# EAGLE design CoffeePal (EAGLE 9.6.2)
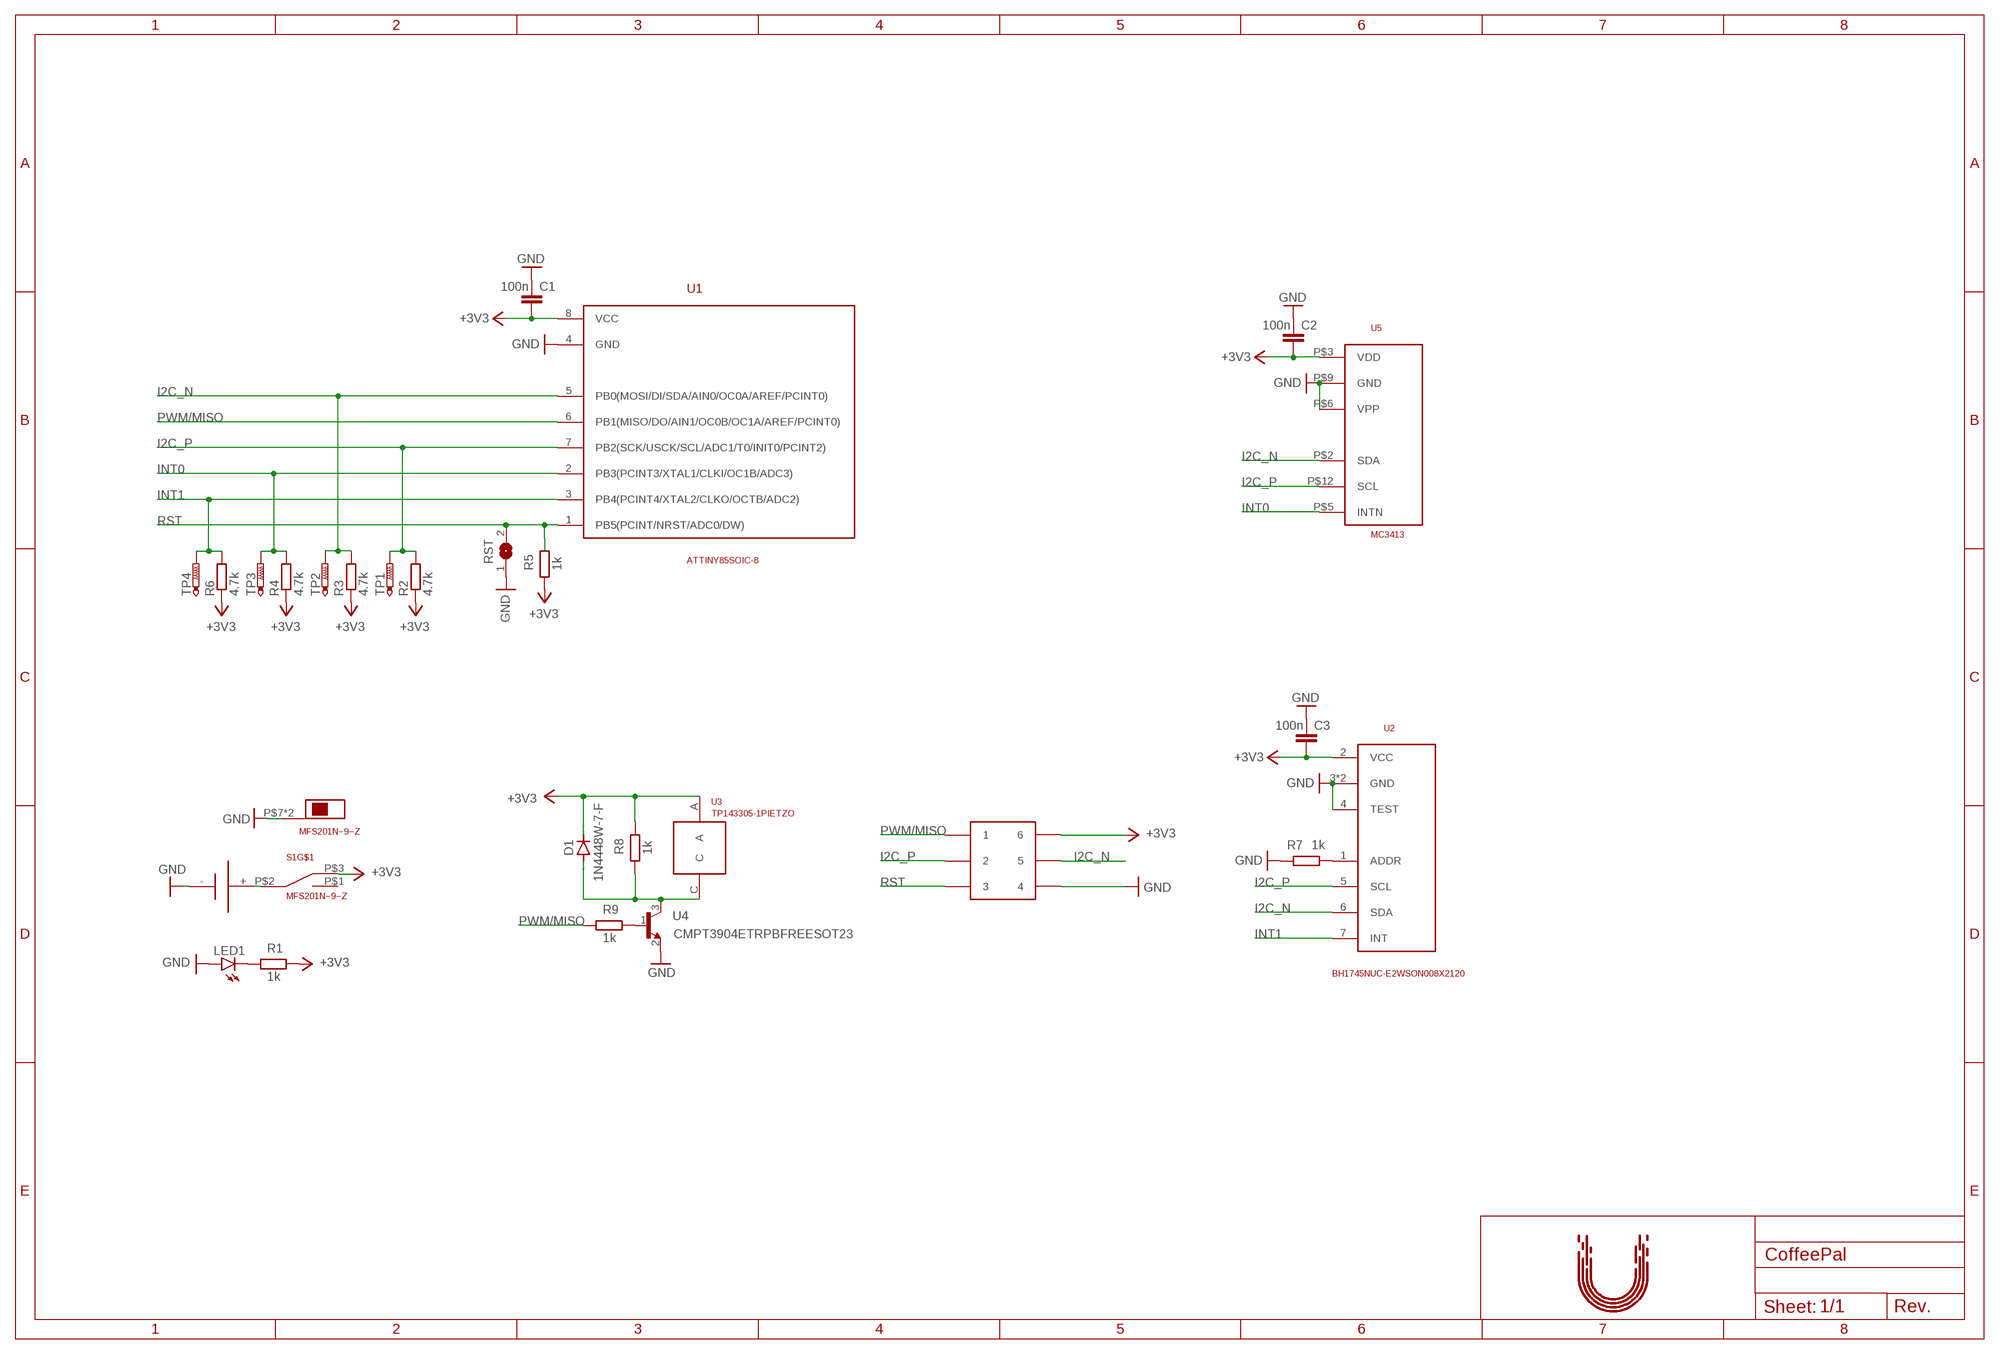
[diagram p0: schematic, sheet 1]

## Parts
C1  100n  CAPACITORC-0603  [0603]
C2  100n  CAPACITORC-0603  [0603]
C3  100n  CAPACITORC-0603  [0603]
D1  1N4448W-7-F  DIODE1  [SOD-123_MINI-SMA]
LED1  LEDLED_1206  [DIOC3216X75N]
PROGRAM  3X2_PINHEADER3X2_PINHEADER  [HDRV6W64P254_2X3_900X508X838B]
R1  1k  RESISTOR  [R0603]
R2  4.7k  RESISTOR  [R0603]
R3  4.7k  RESISTOR  [R0603]
R4  4.7k  RESISTOR  [R0603]
R5  1k  RESISTOR  [R0603]
R6  4.7k  RESISTOR  [R0603]
R7  1k  RESISTOR  [R0603]
R8  1k  RESISTOR  [R0603]
R9  1k  RESISTOR  [R0603]
RST  JUMPER  [SJ]
S1  MFS201N−9−Z  [MFS201N-9-Z]
TP1  PTR1B1,27  [B1,27]
TP2  PTR1B1,27  [B1,27]
TP3  PTR1B1,27  [B1,27]
TP4  PTR1B1,27  [B1,27]
U1  ATTINY85SOIC-8  [SOIC127P798X216-8N]
U2  BH1745NUC-E2WSON008X2120  [SON50P210X200X60-9T75X150N]
U3  TP143305-1PIETZO  [SODFL151143X1070N]
U4  CMPT3904ETRPBFREESOT23  [SOT95P240X110-3N]
U5  MC3413  [VLGA-12]
U$2  1061TR  [1061TR]
U$3  UTBULT_DESIGN1  [UD_1]

## Nets
+3V3: C1.2 C2.2 C3.2 D1.C PROGRAM.6 R1.2 R2.1 R3.1 R4.1 R5.1 R6.1 R8.2 S1.P$3 U1.8(VCC) U2.2(VCC) U3.A U5.P$3(VDD)
GND: C1.1 C2.1 C3.1 LED1.A PROGRAM.4 R7.1 RST.1 S1.P$7 S1.P$8 U1.4(GND) U2.3(GND) U2.4(TEST) U2.9(GND) U4.2(E) U5.P$6(VPP) U5.P$9(GND) U$2.-
I2C_N [SPI]: PROGRAM.5 R3.2 TP2.TP U1.5(PB0(MOSI/DI/SDA/AIN0/OC0A/AREF/PCINT0)) U2.6(SDA) U5.P$2(SDA)
I2C_P [SPI]: PROGRAM.2 R2.2 TP1.TP U1.7(PB2(SCK/USCK/SCL/ADC1/T0/INIT0/PCINT2)) U2.5(SCL) U5.P$12(SCL)
INT0: R4.2 TP3.TP U1.2(PB3(PCINT3/XTAL1/CLKI/OC1B/ADC3)) U5.P$5(INTN)
INT1: R6.2 TP4.TP U1.3(PB4(PCINT4/XTAL2/CLKO/OCTB/ADC2)) U2.7(INT)
N$1: S1.P$2 U$2.+
N$2: LED1.C R1.1
N$4: R7.2 U2.1(ADDR)
N$6: R9.2 U4.1(B)
N$7: D1.A R8.1 U3.C U4.3(C)
PWM/MISO [SPI]: PROGRAM.1 R9.1 U1.6(PB1(MISO/DO/AIN1/OC0B/OC1A/AREF/PCINT0))
RST: PROGRAM.3 R5.2 RST.2 U1.1(PB5(PCINT/NRST/ADC0/DW))
Unconnected: S1.P$1 S1.P$4 S1.P$5 S1.P$6

## Library data of the parts
C1-C3 = lib:CAPACITOR: Capacitor
D1 = lib:DIODE: Molded plasitc,JEDEC SOD-123/Mini SMA Source: Comchip CGRM4001-G.pdf; LINK: https://www.mouser.se/ProductDetail/Diodes-Incorporated/1N4448W-7-F?qs=VlTXaPCrgsfMz34DB76PhQ%3D%3D; MPN: 1N4448W-7-F; SUPPLIER: Mouser
LED1 = lib:LED
PROGRAM = lib:3X2_PINHEADER; LINK: https://eu.mouser.com/ProductDetail/TE-Connectivity/5-146258-3?qs=lf8um9gOXCICbEgdwHMcdQ%3D%3D; MPN: 5-146258-3; SUPPLIER: Mouser
R1-R9 = lib:RESISTOR
RST = lib:JUMPER: SMD solder JUMPER
S1 = lib:MFS201N−9−Z: Switch Slide Switches DPDT thru-hole terminals, ON - ON function, 5.0mm long top actuator; LINK: https://eu.mouser.com/ProductDetail/Nidec-Copal/MFS201N-9-Z?qs=XeJtXLiO41Ra%252BPt0rLIsIw%3D%3D; MPN: MFS201N−9−Z; SUPPLIER: Mouser
TP1-TP4 = lib:PTR1: TEST PIN
U1 = lib:ATTINY85: ATTiny 85 8-bit Microcontrollers - MCU 8K FLSH 512B EE SRAM ADC 8PINS-10MHz 1.8V; LINK: https://www.mouser.se/ProductDetail/Microchip-Technology-Atmel/ATTINY85V-10SUR?qs=6Dg1WZIWLC7RsRgydzBFFw%3D%3D; MPN: ATTINY85V-10SUR; SUPPLIER: Mouser
U2 = lib:BH1745NUC-E2: Photosensor Optical Sensors - Light to Digital Converters ALS Dig 16bit Color Sensor IC; LINK: https://eu.mouser.com/ProductDetail/ROHM-Semiconductor/BH1745NUC-E2?qs=sGAEpiMZZMsl3GqdWuceyV%252BQQM5BSZYEsH1kp3vGHd8HHhaGJnnfYQ%3D%3D; MPN: BH1745NUC-E2; SUPPLIER: Mouser
U3 = lib:TP143305-1: Pietzo Speakers & Transducers Piezo Transducer; LINK: https://eu.mouser.com/ProductDetail/DB-Unlimited/TP143305-1?qs=t9M3m0YJX4N5fN9KSkHojQ%3D%3D; MPN: TP143305-1; SUPPLIER: Mouser
U4 = lib:CMPT3904ETRPBFREE: NPN Transistor Bipolar Transistors - BJT NPN Enhanced Complimentary; LINK: https://eu.mouser.com/ProductDetail/Central-Semiconductor/CMPT3904E-TR-PBFREE?qs=u16ybLDytRZdO89O3AipsA%3D%3D; MPN: CMPT3904E TR PBFREE; SUPPLIER: Mouser
U5 = lib:MC3413: Accelerometer Accelerometers 2x2 High Resolution Gen 3; LINK: https://eu.mouser.com/ProductDetail/MEMSIC/MC3413?qs=8TPl4Kup7ocS%2FG2RQqpI2Q%3D%3D; MPN: MC3413; SUPPLIER: Mouser
U$2 = lib:1061TR: Battery clip Coin Cell Battery Holders 1X20mm SMT COIN HOLDER - T/R; LINK: https://eu.mouser.com/ProductDetail/Keystone-Electronics/1061TR?qs=q0tsjPZWdm8mEkIEudXsxA%3D%3D; MPN: 1061TR; SUPPLIER: Mouser
U$3 = lib:UTBULT_DESIGN

## Net classes
1 I2C: width 0.254 mm
2 SPI: width 0.254 mm

## Board
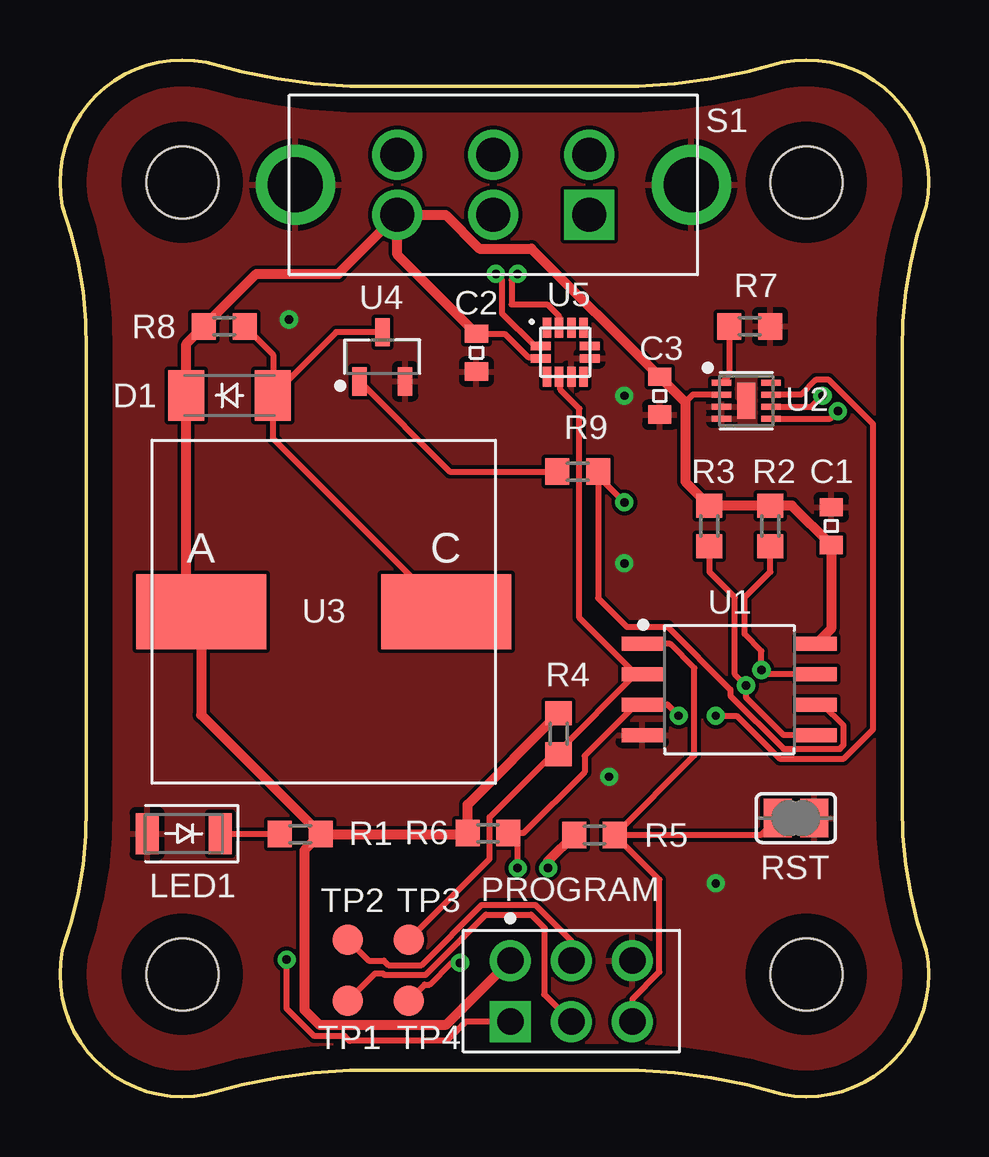
[diagram p1: board, top side]
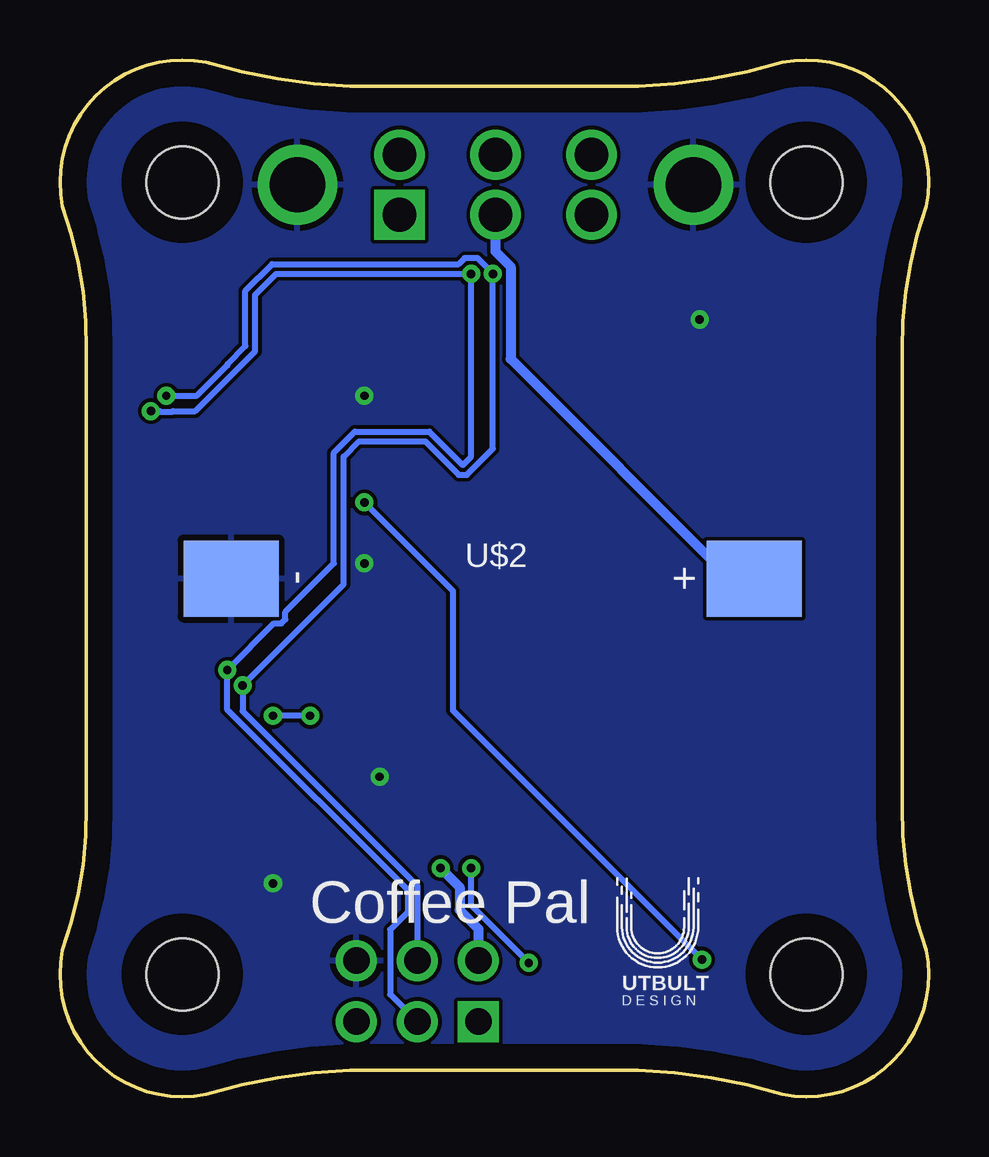
[diagram p2: board, bottom side, seen from below]

Size 36.2 x 43.2 mm. Coordinates in mm from the lower left corner, seen from the top.
Outline: 6.1,43.1 arc113 0.1,37.1 arc-21 1.1,31.1 1.1,12.1 arc-21 0.1,6.1 arc113 6.1,0.1 arc-15 12.1,1.1 24.1,1.1 arc-15 30.1,0.1 arc113 36.1,6.1 arc-21 35.1,12.1 35.1,31.1 arc-21 36.1,37.1 arc113 30.1,43.1 arc-15 24.1,42.1 12.1,42.1 arc-15 6.1,43.1
Copper layers (1*16): Top 0.035mm / dielectric 1.5mm / Bottom 0.035mm
Design rules "default": minimum track width 6mil, minimum drill 0.35mm, track to track 6mil, track to pad 6mil, pad to pad 6mil, via to via 6mil, smd to smd 6mil, copper to edge 40mil, drill to drill 6mil, minimum pad ring 10mil, minimum via ring 8mil, stop-mask expansion 4mil, vias tented up to drill 0mil, thermal gap 10mil
Holes 3 mm at 5.1,38.1 31.1,38.1 5.1,5.1 31.1,5.1

### Footprints (pad centres in the part's own frame; a part is rotated, then mirrored left to right if it is on the bottom)
0603 = smd 0.762 x 0.965: 1 -0.787,0; 2 0.787,0
SOD-123_MINI-SMA = smd 1.5 x 2.1: A 1.8,0; C -1.8,0
DIOC3216X75N = smd 0.962 x 1.712: A 1.525,0; C -1.525,0
HDRV6W64P254_2X3_900X508X838B = drill 1.105 pad 1.705 square: 1 0,-2.54 | drill 1.105 pad 1.705: 2 2.54,-2.54; 3 5.08,-2.54; 4 5.08,0; 5 2.54,0; 6 0,0
R0603 = smd 1 x 1.1: 1 -0.85,0; 2 0.85,0
SJ = smd 1.168 x 1.6: 1 -0.762,0; 2 0.762,0
MFS201N-9-Z = drill 1.4 square: P$1 0,0 | drill 1.4: P$2 4,0; P$3 8,0; P$4 0,-2.5; P$5 4,-2.5; P$6 8,-2.5 | drill 2.3: P$7 -4.25,-1.25; P$8 12.25,-1.25
B1,27 = smd 1.27 x 1.27: TP 0,0
SOIC127P798X216-8N = smd 1.714 x 0.582: 1 -3.628,1.905; 2 -3.628,0.635; 3 -3.628,-0.635; 4 -3.628,-1.905; 5 3.628,-1.905; 6 3.628,-0.635; 7 3.628,0.635; 8 3.628,1.905
SON50P210X200X60-9T75X150N = smd 0.813 x 0.254: 1 -1.025,0.75; 2 -1.025,0.25; 3 -1.025,-0.25; 4 -1.025,-0.75; 5 1.025,-0.75; 6 1.025,-0.25; 7 1.025,0.25; 8 1.025,0.75 | smd 0.75 x 1.5: 9 0,0
SODFL151143X1070N = smd 5.42 x 3.112: A -5.105,0; C 5.105,0
SOT95P240X110-3N = smd 1.18 x 0.609: 1 -1.024,0.95; 2 -1.024,-0.95; 3 1.024,0
VLGA-12 = smd 0.356 x 0.838: P$1 -0.762,1.016; P$4 -0.762,-1.016; P$5 -0.254,-1.016; P$6 0.254,-1.016; P$7 0.762,-1.016; P$10 0.762,1.016; P$11 0.254,1.016; P$12 -0.254,1.016 | smd 0.838 x 0.356: P$2 -1.016,0.254; P$3 -1.016,-0.254; P$8 1.016,0.254; P$9 1.016,-0.254
1061TR = smd 3.17 x 3.96: + 0,-10.8; - 0,11

### Placement (x,y rotation side)
C1  32.13,23.78 270 top
C2  17.35,31 90 top
C3  24.99,29.21 90 top
D1  7.07,29.22 0 top
LED1  5.16,10.97 180 top
PROGRAM  18.77,5.67 0 top
R1  10.01,10.94 0 top
R2  29.59,23.78 270 top
R3  27.05,23.78 270 top
R4  20.78,15.12 270 top
R5  22.27,10.91 0 top
R6  17.83,10.98 0 top
R7  28.74,32.1 180 top
R8  6.85,32.1 180 top
R9  21.57,26.05 180 top
RST  30.66,11.61 180 top
S1  22.05,36.75 180 top
TP1  11.99,4 0 top
TP2  11.99,6.54 0 top
TP3  14.53,6.54 0 top
TP4  14.53,4 0 top
U1  27.89,16.97 0 top
U2  28.59,29 0 top
U3  10.99,20.21 0 top
U4  13.43,30.83 90 top
U5  21.05,31.02 0 top
U$2  18.07,21.59 90 bottom
U$3  11.27,7.1 0 bottom

### Tracks (layer width: path | path; a pad name or v marks a point on that pad's centre or on a via)
+3V3  (via drill 0.35)
  Top 0.254: U2.2 26.37,29.25 26.05,28.93 | U5.P$3 19.99,30.82 19.5,30.82 18.53,31.79 C2.2
  Top 0.406: S1.P$3 11.59,34.29 8.19,34.29 R8.2 5.27,31.37 D1.C 5.27,20.21 U3.A 5.88,15.91 R1.2 | C2.2 14.05,35.09 S1.P$3 | S1.P$3 16.07,36.75 17.47,35.34 19.64,35.34 C3.2 26.05,28.93 26.05,25.63 R3.1 R2.1 30.5,24.63 C1.2 32.13,19.49 U1.8 | R1.2 16.94,10.94 R6.1 16.98,12.18 R4.1 | R5.1 20.34,9.83 v20.34,9.52 | R1.2 10.18,10.26 10.18,3.62 10.8,3.01 16.1,3.01 PROGRAM.6
  Bottom 0.406: v20.34,9.52 19.55,8.74 19.55,7.78 18.77,7 PROGRAM.6
GND  (via drill 0.35)
  other vias: 23.51,22.22 22.88,13.33 27.32,8.89 23.51,29.21 9.54,32.38
  pour Top: -1.25,45.72 38.12,45.72 38.12,-1.27 -1.25,-1.27
  pour Bottom: -1.25,45.72 38.12,45.72 38.12,-1.27 -1.25,-1.27
I2C_N  (via drill 0.35)
  Top 0.254: U1.5 30.15,15.06 28.59,16.63 v28.59,17.14 28.12,17.6 28.12,20.8 27.05,21.87 R3.2 | v18.16,34.29 18.41,34.04 18.41,32.66 19.8,31.27 U5.P$2 | v31.77,29.21 31.31,28.75 U2.6 | PROGRAM.5 21.31,6.49 19.8,8 17.58,8 15.06,5.48 13.68,5.48 13.49,5.67 12.86,5.67 TP2.TP
  Bottom 0.254: v31.77,29.21 30.5,29.21 29.23,30.48 29.23,30.53 28.47,31.29 28.47,33.58 27.36,34.7 19.59,34.7 19.34,34.95 18.8,34.95 18.41,34.56 18.41,34.54 v18.16,34.29 18.16,27 19.25,25.92 19.59,25.92 20.97,27.3 23.74,27.3 24.38,26.67 24.38,21.35 v28.59,17.14 28.59,16.06 21.31,8.78 PROGRAM.5
I2C_P  (via drill 0.35)
  Top 0.254: U1.7 29.4,17.6 v29.23,17.78 29.23,18.57 28.53,19.27 28.53,20.8 29.59,21.87 R2.2 | v19.07,34.29 18.82,34.04 18.82,33.02 20.3,33.02 20.8,32.52 U5.P$12 | v32.41,28.57 32.1,28.25 U2.5 | PROGRAM.2 20.17,4.26 20.17,6.92 20.21,6.95 20.21,7.02 19.63,7.59 17.75,7.59 15.23,5.07 13.51,5.07 13.45,5.14 13.13,5.14 TP1.TP
  Bottom 0.254: v32.41,28.57 32.06,28.57 32.04,28.55 31.5,28.55 31.48,28.57 30.57,28.57 28.06,31.07 28.06,33.42 27.19,34.29 v19.07,34.29 19.07,26.67 19.42,26.32 20.81,27.71 23.91,27.71 24.78,26.84 24.78,22.22 26.81,20.2 26.81,19.89 26.97,19.72 27.28,19.72 v29.23,17.78 29.24,17.76 29.24,16.15 21.71,8.62 21.71,7.69 22.44,6.97 22.44,4.26 PROGRAM.2
INT0
  Top 0.254: TP3.TP 17.9,9.91 17.9,11.65 20.53,14.27 R4.2 20.78,14.41 23.97,17.6 U1.2 23.99,17.6 21.64,19.95 21.64,28.67 20.85,29.47 20.85,29.95 U5.P$5
INT1  (via drill 0.35)
  Top 0.254: TP4.TP 15.2,4.67 15.4,4.67 16.31,5.58 v16.67,5.58 | v19.07,9.52 19.07,10.59 R6.2 19.31,10.98 21.86,13.53 21.86,14.21 23.99,16.33 U1.3 25.32,16.33 v25.78,15.87 | v27.32,15.87 28.19,15.87 29.98,14.09 32.66,14.09 33.88,15.31 33.88,28.03 32.04,29.87 31.5,29.87 30.88,29.25 U2.7
  Bottom 0.254: v16.67,5.58 19.07,7.98 v19.07,9.52 | v25.78,15.87 v27.32,15.87
N$1
  Bottom 0.406: S1.P$2 18.05,35.22 17.43,34.59 17.43,30.74 8.27,21.59 U$2.+
N$2
  Top 0.254: R1.1 6.71,10.94 LED1.C
N$4
  Top 0.254: R7.2 27.89,30.07 U2.1
N$6
  Top 0.254: U4.1 16.24,26.05 R9.2
N$7
  Top 0.254: U4.3 11.5,31.86 8.88,29.24 | 8.88,29.24 D1.A 8.87,27.43 U3.C | R8.1 8.88,30.91 8.88,29.24
PWM/MISO  (via drill 0.35)
  Top 0.254: U1.6 31.79,16.33 32.65,15.47 32.65,14.66 32.49,14.49 30.15,14.49 27.93,16.71 27.93,16.97 25.32,19.58 23.62,19.58 22.42,20.78 R9.1 22.42,25.86 v23.51,24.76 | PROGRAM.1 16.91,3.13 16.11,2.34 12.52,2.34 12.08,2.32 11.87,2.52 10.6,2.52 9.45,3.67 v9.45,5.71
  Bottom 0.254: v9.45,5.71 19.83,16.1 19.83,21.08 v23.51,24.76
RST
  Top 0.254: U1.1 25.42,18.87 26.44,17.86 26.44,14.22 R5.2 | PROGRAM.3 23.85,4.07 24.98,5.2 24.98,9.05 R5.2 | RST.2 29.19,10.91 R5.2

### Text on the board
bPlace: Coffee Pal